# Altium schematic sheet SENSOR.SchDoc: SENSOR
size A4
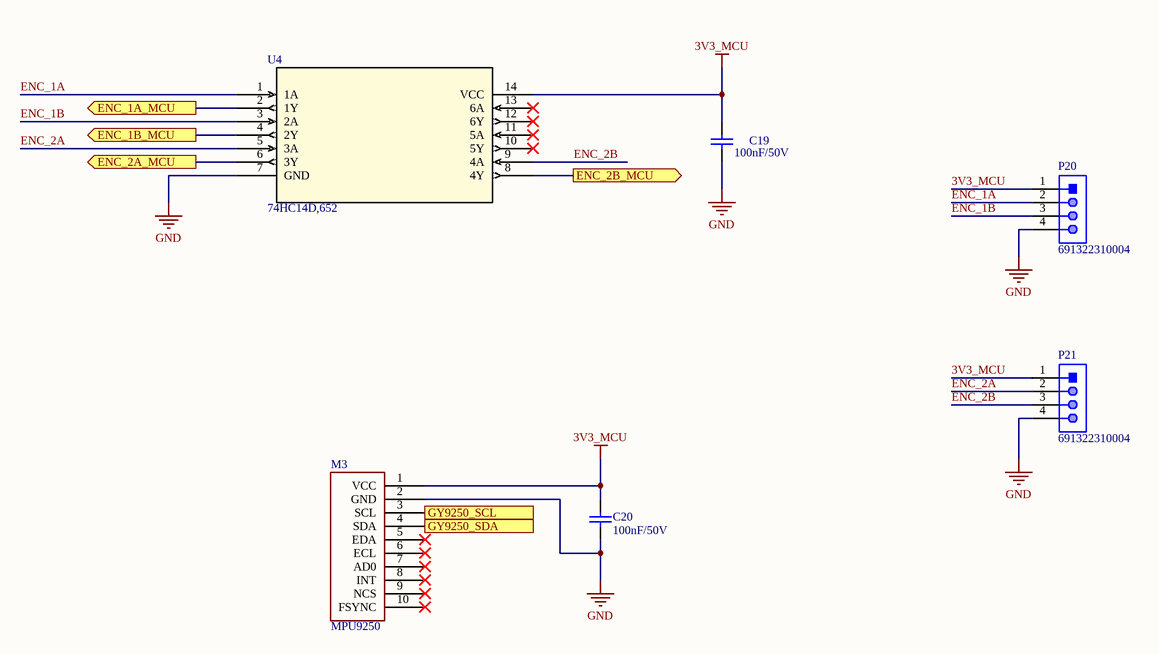
[diagram p0: SENSOR.SchDoc]

## Parts
C19  value 100nF/50V  [CAP-SM-0805]  (hidden comment: Cap-1nF-50V-0805)
C20  value 100nF/50V  [CAP-SM-0805]  (hidden comment: Cap-1nF-50V-0805)
M3  MPU9250  [MPU9250]
P20  691322310004  [691322310004]
P21  691322310004  [691322310004]
U4  74HC14D,652  [74hc14d]

## Ports
ENC_1A_MCU (out), ENC_1B_MCU (out), ENC_2A_MCU (out), ENC_2B_MCU (out), GY9250_SCL (in), GY9250_SDA (in)

## Nets
3V3_MCU: C19.2 C20.2 M3.1(VCC) P20.1 P21.1 U4.14(VCC)
GND: C19.1 C20.1 M3.2(GND) P20.4 P21.4 U4.7(GND)
ENC_1A: P20.2 U4.1(1A)
ENC_1A_MCU: U4.2(1Y) ; port ENC_1A_MCU
ENC_1B: P20.3 U4.3(2A)
ENC_1B_MCU: U4.4(2Y) ; port ENC_1B_MCU
ENC_2A: P21.2 U4.5(3A)
ENC_2A_MCU: U4.6(3Y) ; port ENC_2A_MCU
ENC_2B: P21.3 U4.9(4A)
ENC_2B_MCU: U4.8(4Y) ; port ENC_2B_MCU
GY9250_SCL: M3.3(SCL) ; port GY9250_SCL
GY9250_SDA: M3.4(SDA) ; port GY9250_SDA

Not connected (* = marked no-connect by the designer): M3 5(EDA)* 6(ECL)* 7(AD0)* 8(INT)* 9(NCS)* 10(FSYNC)*; U4 10(5Y)* 11(5A)* 12(6Y)* 13(6A)*

## Notes on the sheet
- Title
- Size:
- Date:
- A4
- Number:
- Time:
- Revision:
- Sheet
- of
- File:

## Library data of the parts
C19 C20 = Cap-1nF-50V-0805: CAP CER 1000PF 100V X7R 0805; Manufacturer: Johanson Dielectrics Inc.; Manufacturer Part Number: 101X15W102MV4E; Local Supplier: thegioiic; Local Supplier Link: https://thegioiic.com/products/tu-1nf-50v-0805; Supplier 1: Digikey; Supplier 1 Link: https://www.digikey.com/product-detail/en/johanson-dielectrics-inc/101X15W102MV4E/709-1335-1-ND/2327235; Supplier 1 Part Number: 709-1335-1-ND
P20 P21 = 691322310004: WR-TBL Serie 322 Horizontal PCB Header, Pluggable, pitch 3.81mm, 4p; Compliance: RoHS; Modularity: No; Pin Number: 4; Rated Current [UL]: 10A; Working Voltage [UL]: 300VAC; ComponentLink1Description: Manufacturer; ComponentLink1URL: http://www.we-online.de; ComponentLink2URL: https://katalog.we-online.de/em/datasheet/691322310004.pdf; ComponentLink2Description: Datasheet; Mounting Technology: THT; Part Number: 691322310004; Packaging: Box; Operating Temperature: -40 to +105degC; PCB/Cable/Panel: PCB; Pitch: 3.81mm; Published Date: October 2019; Type: Horizontal; Publisher: Wurth Elektronik; Application: Pluggable
U4 = 74HC14D,652: No Description Available; Vendor: Nexperia; SourceLibrary: Nexperia_2018-05-2018; Manufacturer_Part_Number: 74HC14D,652; Copyright: Copyright (C) 2016 Accelerated Designs. All rights reserved; RefDes: RefDes; Type: DEV